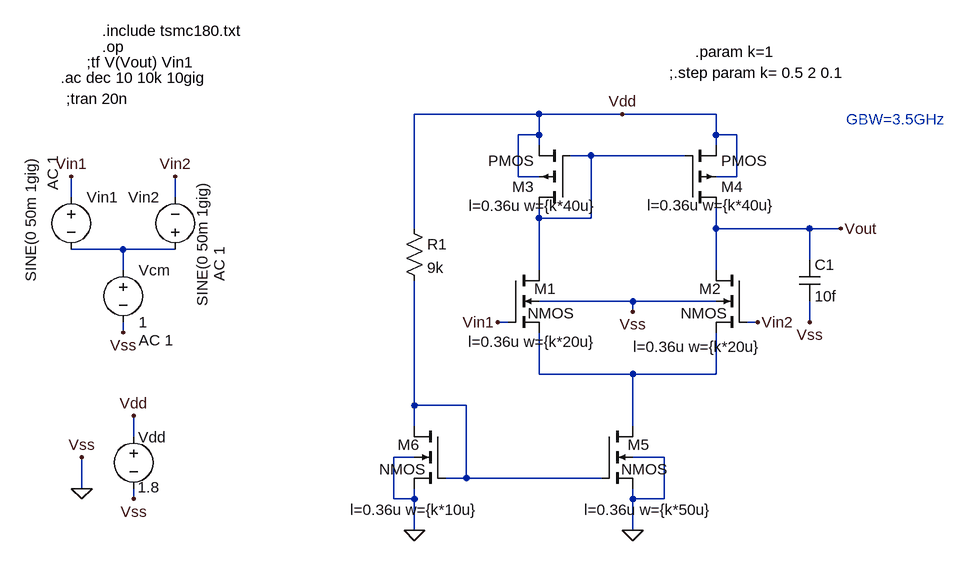
[diagram p0: schematic OP_AMP_44_5GHz.asc]
OP_AMP_44_5GHz.asc, the LTspice schematic file:
Version 4
SHEET 1 1824 708
WIRE 1136 16 944 16
WIRE 1264 16 1136 16
WIRE 1408 16 1264 16
WIRE 1136 48 1136 16
WIRE 1136 48 1104 48
WIRE 1408 48 1408 16
WIRE 1440 48 1408 48
WIRE 1136 64 1136 48
WIRE 1408 64 1408 48
WIRE 1216 80 1184 80
WIRE 1360 80 1216 80
WIRE 1104 112 1104 48
WIRE 1136 112 1104 112
WIRE 1440 112 1440 48
WIRE 1440 112 1408 112
WIRE 416 144 416 112
WIRE 576 144 576 112
WIRE 1136 176 1136 160
WIRE 1216 176 1216 80
WIRE 1216 176 1136 176
WIRE 944 192 944 16
WIRE 1408 192 1408 160
WIRE 1552 192 1408 192
WIRE 1600 192 1552 192
WIRE 496 224 416 224
WIRE 576 224 496 224
WIRE 1552 240 1552 192
WIRE 496 256 496 224
WIRE 1136 256 1136 176
WIRE 1408 256 1408 192
WIRE 1280 304 1136 304
WIRE 1408 304 1280 304
WIRE 1280 320 1280 304
WIRE 1088 336 1072 336
WIRE 1472 336 1456 336
WIRE 1552 336 1552 304
WIRE 496 352 496 336
WIRE 1136 416 1136 352
WIRE 1280 416 1136 416
WIRE 1408 416 1408 352
WIRE 1408 416 1280 416
WIRE 944 464 944 272
WIRE 1024 464 944 464
WIRE 944 496 944 464
WIRE 1280 496 1280 416
WIRE 512 512 512 480
WIRE 944 544 912 544
WIRE 1328 544 1280 544
WIRE 1024 576 1024 464
WIRE 1024 576 992 576
WIRE 1232 576 1024 576
WIRE 432 592 432 544
WIRE 512 608 512 592
WIRE 912 608 912 544
WIRE 944 608 944 592
WIRE 944 608 912 608
WIRE 1280 608 1280 592
WIRE 1328 608 1328 544
WIRE 1328 608 1280 608
WIRE 944 656 944 608
WIRE 1280 656 1280 608
FLAG 432 592 0
FLAG 432 544 Vss
FLAG 512 608 Vss
FLAG 496 352 Vss
FLAG 512 480 Vdd
FLAG 1072 336 Vin1
FLAG 1264 16 Vdd
FLAG 1472 336 Vin2
FLAG 1280 320 Vss
FLAG 416 112 Vin1
FLAG 576 112 Vin2
FLAG 1552 336 Vss
FLAG 1600 192 Vout
FLAG 1280 656 0
FLAG 944 656 0
SYMBOL nmos4 1088 256 R0
WINDOW 0 40 29 Left 2
WINDOW 3 30 66 Left 2
WINDOW 123 135 110 Right 2
SYMATTR InstName M1
SYMATTR Value2 l=0.36u w={k*20u}
SYMBOL voltage 512 496 R0
WINDOW 123 0 0 Left 0
WINDOW 39 0 0 Left 0
WINDOW 0 7 17 Left 2
WINDOW 3 6 94 Left 2
SYMATTR InstName Vdd
SYMATTR Value 1.8
SYMBOL nmos4 1456 256 M0
WINDOW 0 40 29 Left 2
WINDOW 3 30 66 Left 2
WINDOW 123 -21 118 Left 2
SYMATTR InstName M2
SYMATTR Value2 l=0.36u w={k*20u}
SYMBOL voltage 496 240 R0
WINDOW 123 24 124 Left 2
WINDOW 39 0 0 Left 0
SYMATTR Value2 AC 1
SYMATTR InstName Vcm
SYMATTR Value 1
SYMBOL voltage 416 128 R0
WINDOW 3 -62 -46 VRight 2
WINDOW 123 -28 -48 VRight 2
WINDOW 39 0 0 Left 0
SYMATTR Value SINE(0 50m 1gig)
SYMATTR Value2 AC 1
SYMATTR InstName Vin1
SYMBOL voltage 576 240 R180
WINDOW 0 24 96 Left 2
WINDOW 3 -42 -72 VRight 2
WINDOW 123 -68 -33 VRight 2
WINDOW 39 0 0 Left 0
SYMATTR InstName Vin2
SYMATTR Value SINE(0 50m 1gig)
SYMATTR Value2 AC 1
SYMBOL pmos4 1184 160 R180
WINDOW 123 -40 3 Left 2
SYMATTR Value2 l=0.36u w={k*40u}
SYMATTR InstName M3
SYMBOL pmos4 1360 160 M180
WINDOW 123 -58 4 Left 2
SYMATTR Value2 l=0.36u w={k*40u}
SYMATTR InstName M4
SYMBOL cap 1536 240 R0
SYMATTR InstName C1
SYMATTR Value 10f
SYMBOL nmos4 1232 496 R0
WINDOW 0 40 29 Left 2
WINDOW 3 30 66 Left 2
WINDOW 123 170 129 Right 2
SYMATTR InstName M5
SYMATTR Value2 l=0.36u w={k*50u}
SYMBOL nmos4 992 496 M0
WINDOW 0 40 29 Left 2
WINDOW 3 30 66 Left 2
WINDOW 123 147 129 Right 2
SYMATTR InstName M6
SYMATTR Value2 l=0.36u w={k*10u}
SYMBOL res 928 176 R0
SYMATTR InstName R1
SYMATTR Value 9k
TEXT 464 -112 Left 2 !.include tsmc180.txt
TEXT 464 -88 Left 2 !.op
TEXT 440 -64 Left 2 !;tf V(Vout) Vin1
TEXT 400 -40 Left 2 !.ac dec 10 10k 10gig
TEXT 408 -8 Left 2 !;tran 20n
TEXT 1336 -48 Left 2 !;.step param k= 0.5 2 0.1
TEXT 1376 -80 Left 2 !.param k=1
TEXT 1608 24 Left 2 ;GBW=3.5GHz

The netlist it stands for:
* OP_AMP_44_5GHz.asc
M1 N001 Vin1 N003 0 NMOS l=0.36u w={k*20u}
Vdd Vdd 0 1.8
M2 Vout Vin2 N003 0 NMOS l=0.36u w={k*20u}
Vcm N002 0 1 AC 1
Vin1 Vin1 N002 SINE(0 50m 1gig) AC 1
Vin2 N002 Vin2 SINE(0 50m 1gig) AC 1
M3 N001 N001 Vdd Vdd PMOS l=0.36u w={k*40u}
M4 Vout N001 Vdd Vdd PMOS l=0.36u w={k*40u}
C1 Vout 0 10f
M5 N003 N004 0 0 NMOS l=0.36u w={k*50u}
M6 N004 N004 0 0 NMOS l=0.36u w={k*10u}
R1 Vdd N004 9k
.model NMOS NMOS
.model PMOS PMOS
.lib standard.mos
.include tsmc180.txt
.op
;tf V(Vout) Vin1
.ac dec 10 10k 10gig
;tran 20n
;.step param k= 0.5 2 0.1
.param k=1
* GBW=3.5GHz
.backanno
.end